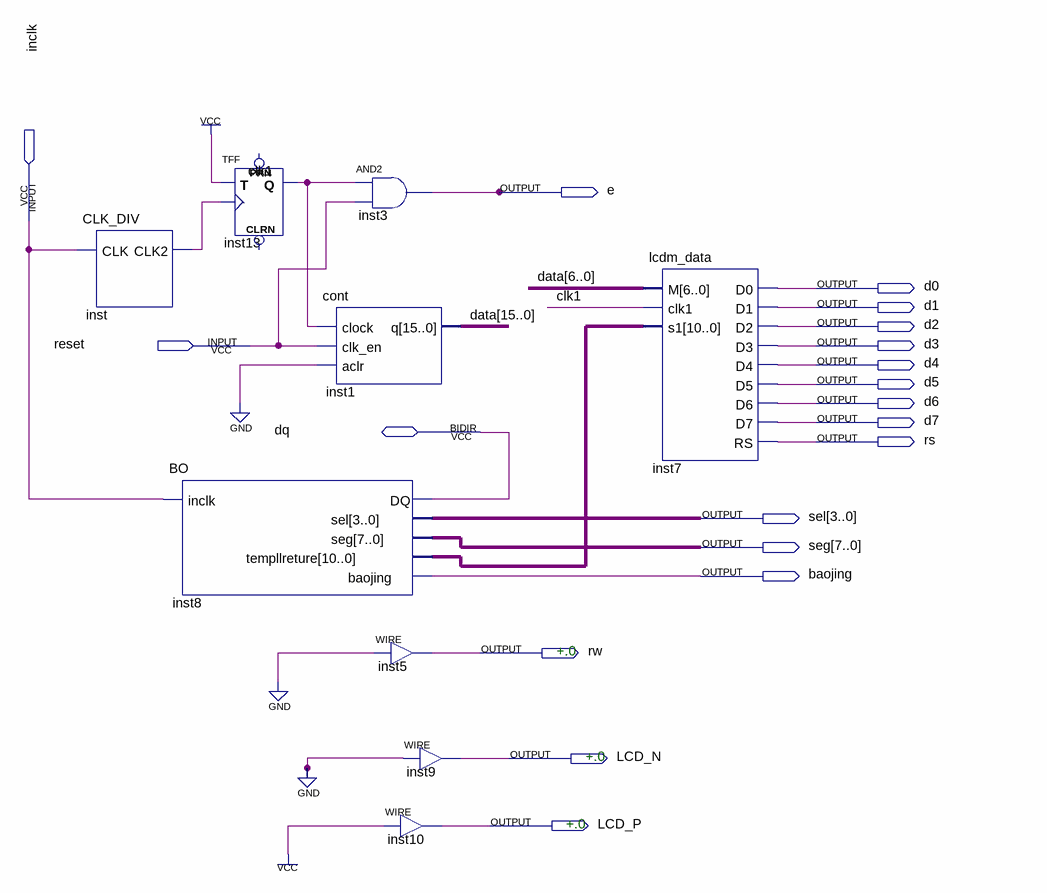
[diagram p0: schematic sheet]
// Quartus schematic DS18B20_LCD1602.bdf as structural Verilog: 9 symbols, 19 pins
module DS18B20_LCD1602 (
  input  inclk,
  input  reset,
  inout  dq,
  output e,
  output d0,
  output d1,
  output d2,
  output d3,
  output d4,
  output d5,
  output d6,
  output d7,
  output rs,
  output [3:0] sel,
  output [7:0] seg,
  output baojing,
  output rw,
  output LCD_N,
  output LCD_P
);

  wire clk1, inst_clk2;
  wire [10:0] inst8_templlreture;
  wire [15:0] data;

  CLK_DIV inst (.CLK(inclk), .CLK2(inst_clk2));
  BO inst8 (.inclk(inclk), .sel(sel), .seg(seg), .templlreture(inst8_templlreture), .baojing(baojing), .DQ(dq));
  TFF inst13 (.T(1'b1), .CLK(inst_clk2), .Q(clk1));  // open: PRN, CLRN
  cont inst1 (.clock(clk1), .clk_en(reset), .aclr(1'b0), .q(data));
  and inst3 (e, clk1, reset);
  assign rw = 1'b0;  // WIRE inst5
  assign LCD_N = 1'b0;  // WIRE inst9
  assign LCD_P = 1'b1;  // WIRE inst10
  lcdm_data inst7 (
    .M(data[6:0]), .clk1(clk1), .s1(inst8_templlreture), .D0(d0), .D1(d1), .D2(d2), .D3(d3), .D4(d4),
    .D5(d5), .D6(d6), .D7(d7), .RS(rs));

  // Notes on the sheet:
  //   +.0
  //   +.0
  //   +.0
endmodule
